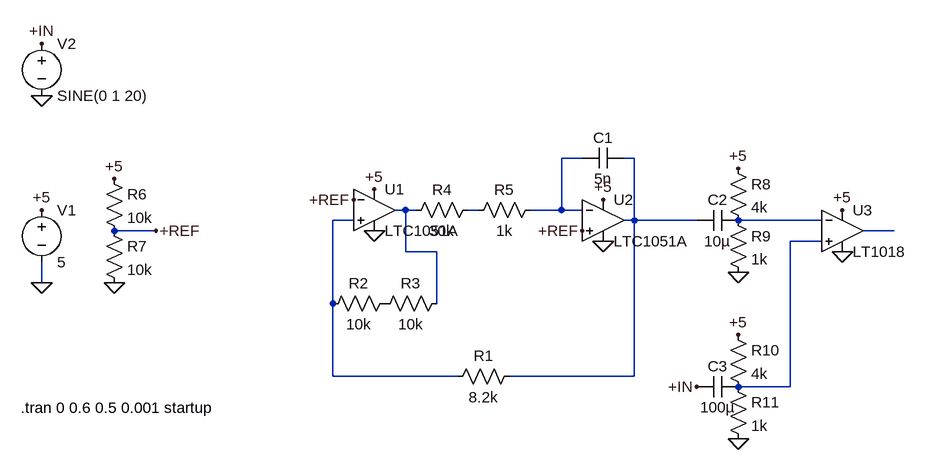
[diagram p0: schematic triangle2.asc]
triangle2.asc, the LTspice schematic file:
Version 4
SHEET 1 880 680
WIRE 368 32 336 32
WIRE 448 32 432 32
WIRE 96 112 80 112
WIRE 112 112 96 112
WIRE 208 112 192 112
WIRE 336 112 336 32
WIRE 336 112 288 112
WIRE 368 112 336 112
WIRE 16 128 -16 128
WIRE 448 128 448 32
WIRE 448 128 432 128
WIRE 544 128 448 128
WIRE 736 128 608 128
WIRE -288 144 -352 144
WIRE 848 144 800 144
WIRE 736 160 688 160
WIRE 96 176 96 112
WIRE 144 176 96 176
WIRE -464 224 -464 192
WIRE -16 256 -16 128
WIRE 144 256 144 176
WIRE -16 368 -16 256
WIRE 176 368 -16 368
WIRE 448 368 448 128
WIRE 448 368 256 368
WIRE 688 384 688 160
WIRE 688 384 608 384
FLAG -464 224 0
FLAG -464 112 +5
FLAG -352 224 0
FLAG -352 64 +5
FLAG -288 144 +REF
FLAG 368 144 +REF
FLAG 16 96 +REF
FLAG 48 144 0
FLAG 400 160 0
FLAG 48 80 +5
FLAG 400 96 +5
FLAG 608 48 +5
FLAG 608 208 0
FLAG -464 -144 +IN
FLAG -464 -64 0
FLAG 768 112 +5
FLAG 768 176 0
FLAG 544 384 +IN
FLAG 608 304 +5
FLAG 608 464 0
SYMBOL res 208 96 R90
WINDOW 0 0 56 VBottom 2
WINDOW 3 32 56 VTop 2
SYMATTR InstName R4
SYMATTR Value 30k
SYMBOL res 304 96 R90
WINDOW 0 0 56 VBottom 2
WINDOW 3 32 56 VTop 2
SYMATTR InstName R5
SYMATTR Value 1k
SYMBOL res 80 240 R90
WINDOW 0 0 56 VBottom 2
WINDOW 3 32 56 VTop 2
SYMATTR InstName R2
SYMATTR Value 10k
SYMBOL res 160 240 R90
WINDOW 0 0 56 VBottom 2
WINDOW 3 32 56 VTop 2
SYMATTR InstName R3
SYMATTR Value 10k
SYMBOL res 272 352 R90
WINDOW 0 0 56 VBottom 2
WINDOW 3 32 56 VTop 2
SYMATTR InstName R1
SYMATTR Value 8.2k
SYMBOL cap 432 16 R90
WINDOW 0 0 32 VBottom 2
WINDOW 3 32 32 VTop 2
SYMATTR InstName C1
SYMATTR Value 5n
SYMBOL voltage -464 96 R0
WINDOW 123 0 0 Left 2
WINDOW 39 0 0 Left 2
SYMATTR InstName V1
SYMATTR Value 5
SYMBOL res -368 48 R0
SYMATTR InstName R6
SYMATTR Value 10k
SYMBOL res -368 128 R0
SYMATTR InstName R7
SYMATTR Value 10k
SYMBOL Opamps\\LTC1051A 48 48 R0
SYMATTR InstName U1
SYMBOL Opamps\\LTC1051A 400 64 R0
SYMATTR InstName U2
SYMBOL cap 608 112 R90
WINDOW 0 0 32 VBottom 2
WINDOW 3 32 32 VTop 2
SYMATTR InstName C2
SYMATTR Value 10µ
SYMBOL res 592 32 R0
SYMATTR InstName R8
SYMATTR Value 4k
SYMBOL res 592 112 R0
SYMATTR InstName R9
SYMATTR Value 1k
SYMBOL voltage -464 -160 R0
WINDOW 123 0 0 Left 2
WINDOW 39 0 0 Left 2
SYMATTR InstName V2
SYMATTR Value SINE(0 1 20)
SYMBOL Comparators\\LT1018 768 144 R0
SYMATTR InstName U3
SYMBOL res 592 288 R0
SYMATTR InstName R10
SYMATTR Value 4k
SYMBOL res 592 368 R0
SYMATTR InstName R11
SYMATTR Value 1k
SYMBOL cap 608 368 R90
WINDOW 0 0 32 VBottom 2
WINDOW 3 32 32 VTop 2
SYMATTR InstName C3
SYMATTR Value 100µ
TEXT -496 416 Left 2 !.tran 0 0.6 0.5 0.001 startup

The netlist it stands for:
* triangle2.asc
R4 N004 N003 30k
R5 N001 N004 1k
R2 P001 N005 10k
R3 N003 P001 10k
R1 N002 N005 8.2k
C1 N002 N001 5n
V1 +5 0 5
R6 +5 +REF 10k
R7 +REF 0 10k
XU1 N005 +REF +5 0 N003 LTC1051  ; LTC1051A, pins In+ In- V+ V- OUT
XU2 +REF N001 +5 0 N002 LTC1051  ; LTC1051A, pins In+ In- V+ V- OUT
C2 N006 N002 10µ
R8 +5 N006 4k
R9 N006 0 1k
V2 +IN 0 SINE(0 1 20)
XU3 N008 N006 +5 0 N007 LT1018  ; pins In+ In- V+ V- OUT
R10 +5 N008 4k
R11 N008 0 1k
C3 N008 +IN 100µ
.tran 0 0.6 0.5 0.001 startup
.lib LTC1.lib
.backanno
.end